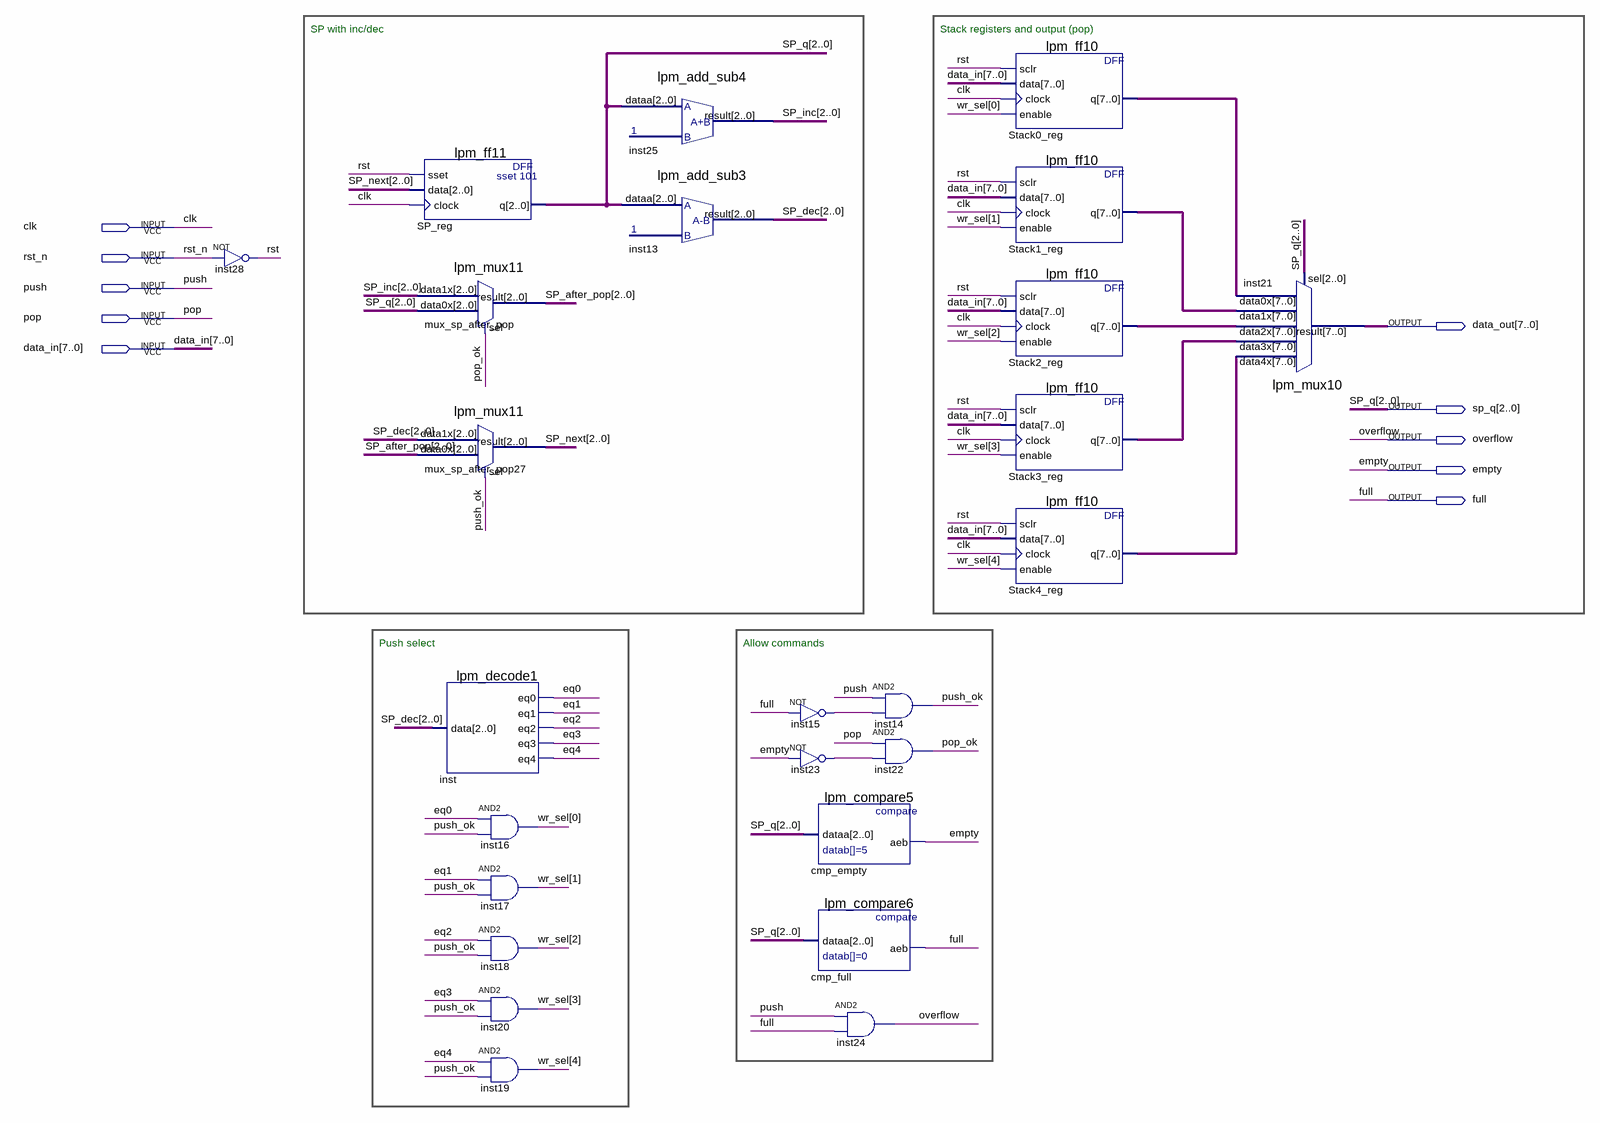
[diagram p0: schematic sheet]
// Quartus schematic stack.bdf as structural Verilog: 25 symbols, 10 pins
module stack (
  input  clk,
  input  rst_n,
  input  push,
  input  pop,
  input  [7:0] data_in,
  output [7:0] data_out,
  output [2:0] sp_q,
  output overflow,
  output empty,
  output full
);

  wire eq0, eq1, eq2, eq3, eq4, inst15_out, inst23_out, pop_ok, push_ok, rst;
  wire [2:0] SP_after_pop, SP_dec, SP_inc, SP_next;
  wire [4:0] wr_sel;
  wire [7:0] Stack0_reg_q, Stack1_reg_q, Stack2_reg_q, Stack3_reg_q, Stack4_reg_q;

  not inst28 (rst, rst_n);
  lpm_ff11 SP_reg (.sset(rst), .data(SP_next), .clock(clk), .q(sp_q));
  lpm_mux11 mux_sp_after_pop (.data1x(SP_inc), .data0x(sp_q), .sel(pop_ok), .result(SP_after_pop));
  lpm_mux11 mux_sp_after_pop27 (.data1x(SP_dec), .data0x(SP_after_pop), .sel(push_ok), .result(SP_next));
  lpm_decode1 inst (.data(SP_dec), .eq0(eq0), .eq1(eq1), .eq2(eq2), .eq3(eq3), .eq4(eq4));
  and inst16 (wr_sel[0], eq0, push_ok);
  and inst17 (wr_sel[1], eq1, push_ok);
  and inst18 (wr_sel[2], eq2, push_ok);
  and inst20 (wr_sel[3], eq3, push_ok);
  and inst19 (wr_sel[4], eq4, push_ok);
  lpm_add_sub4 inst25 (.dataa(sp_q), .result(SP_inc));
  lpm_add_sub3 inst13 (.dataa(sp_q), .result(SP_dec));
  not inst15 (inst15_out, full);
  not inst23 (inst23_out, empty);
  lpm_compare5 cmp_empty (.dataa(sp_q), .aeb(empty));
  lpm_compare6 cmp_full (.dataa(sp_q), .aeb(full));
  and inst14 (push_ok, push, inst15_out);
  and inst22 (pop_ok, pop, inst23_out);
  and inst24 (overflow, push, full);
  lpm_ff10 Stack0_reg (.sclr(rst), .data(data_in), .clock(clk), .enable(wr_sel[0]), .q(Stack0_reg_q));
  lpm_ff10 Stack1_reg (.sclr(rst), .data(data_in), .clock(clk), .enable(wr_sel[1]), .q(Stack1_reg_q));
  lpm_ff10 Stack2_reg (.sclr(rst), .data(data_in), .clock(clk), .enable(wr_sel[2]), .q(Stack2_reg_q));
  lpm_ff10 Stack3_reg (.sclr(rst), .data(data_in), .clock(clk), .enable(wr_sel[3]), .q(Stack3_reg_q));
  lpm_ff10 Stack4_reg (.sclr(rst), .data(data_in), .clock(clk), .enable(wr_sel[4]), .q(Stack4_reg_q));
  lpm_mux10 inst21 (
    .data4x(Stack4_reg_q), .data3x(Stack3_reg_q), .data2x(Stack2_reg_q), .data1x(Stack1_reg_q),
    .data0x(Stack0_reg_q), .sel(sp_q), .result(data_out));

  // Notes on the sheet:
  //   SP with inc/dec
  //   Stack registers and output (pop)
  //   Push select
  //   Allow commands
endmodule
